# Altium schematic sheet Isolators.SchDoc
size 297 x 209 mm; SheetNumber: 17; SheetTotal: 29
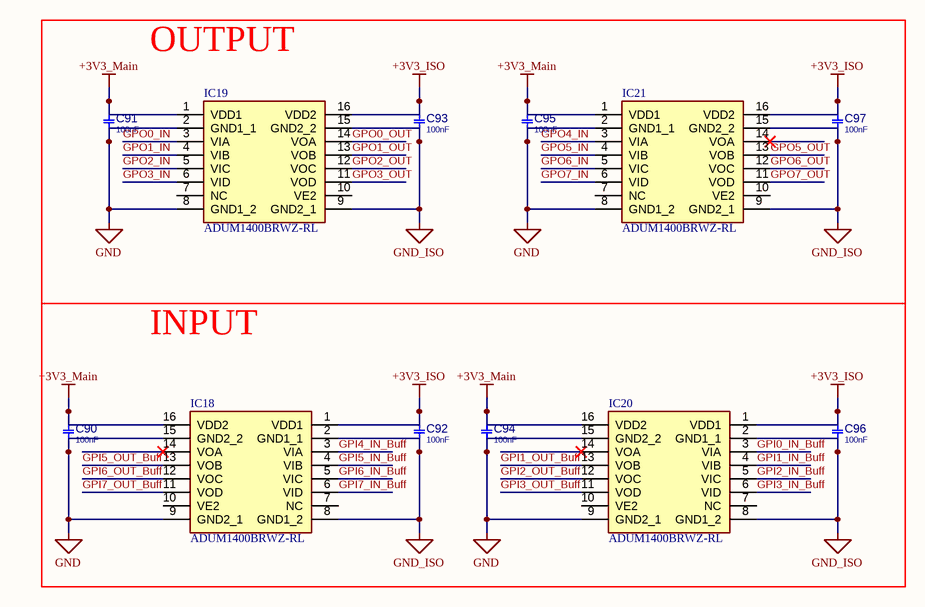
[diagram p0: Isolators.SchDoc]

## Parts
C90  100nF  [C0603]
C91  100nF  [C0603]
C92  100nF  [C0603]
C93  100nF  [C0603]
C94  100nF  [C0603]
C95  100nF  [C0603]
C96  100nF  [C0603]
C97  100nF  [C0603]
IC18  ADUM1400BRWZ-RL  [SOIC127P1032X265-16N]
IC19  ADUM1400BRWZ-RL  [SOIC127P1032X265-16N]
IC20  ADUM1400BRWZ-RL  [SOIC127P1032X265-16N]
IC21  ADUM1400BRWZ-RL  [SOIC127P1032X265-16N]

## Blocks framed on the sheet
OUTPUT: C91 C93 C95 C97 IC19 IC21

## Nets
+3V3_ISO: C92.1 C93.1 C96.1 C97.1 IC18.1(VDD1) IC19.16(VDD2) IC20.1(VDD1) IC21.16(VDD2)
+3V3_Main: C90.1 C91.1 C94.1 C95.1 IC18.16(VDD2) IC19.1(VDD1) IC20.16(VDD2) IC21.1(VDD1)
GND: C90.2 C91.2 C94.2 C95.2 IC18.9(GND2_1) IC18.15(GND2_2) IC19.2(GND1_1) IC19.8(GND1_2) IC20.9(GND2_1) IC20.15(GND2_2) IC21.2(GND1_1) IC21.8(GND1_2)
GND_ISO: C92.2 C93.2 C96.2 C97.2 IC18.2(GND1_1) IC18.8(GND1_2) IC19.9(GND2_1) IC19.15(GND2_2) IC20.2(GND1_1) IC20.8(GND1_2) IC21.9(GND2_1) IC21.15(GND2_2)
GPI0_IN_Buff: IC20.3(VIA)
GPI1_IN_Buff: IC20.4(VIB)
GPI1_OUT_Buff: IC20.13(VOB)
GPI2_IN_Buff: IC20.5(VIC)
GPI2_OUT_Buff: IC20.12(VOC)
GPI3_IN_Buff: IC20.6(VID)
GPI3_OUT_Buff: IC20.11(VOD)
GPI4_IN_Buff: IC18.3(VIA)
GPI5_IN_Buff: IC18.4(VIB)
GPI5_OUT_Buff: IC18.13(VOB)
GPI6_IN_Buff: IC18.5(VIC)
GPI6_OUT_Buff: IC18.12(VOC)
GPI7_IN_Buff: IC18.6(VID)
GPI7_OUT_Buff: IC18.11(VOD)
GPO0_IN: IC19.3(VIA)
GPO0_OUT: IC19.14(VOA)
GPO1_IN: IC19.4(VIB)
GPO1_OUT: IC19.13(VOB)
GPO2_IN: IC19.5(VIC)
GPO2_OUT: IC19.12(VOC)
GPO3_IN: IC19.6(VID)
GPO3_OUT: IC19.11(VOD)
GPO4_IN: IC21.3(VIA)
GPO5_IN: IC21.4(VIB)
GPO5_OUT: IC21.13(VOB)
GPO6_IN: IC21.5(VIC)
GPO6_OUT: IC21.12(VOC)
GPO7_IN: IC21.6(VID)
GPO7_OUT: IC21.11(VOD)

Not connected (* = marked no-connect by the designer): IC18 7(NC) 10(VE2) 14(VOA)*; IC19 7(NC) 10(VE2); IC20 7(NC) 10(VE2) 14(VOA)*; IC21 7(NC) 10(VE2) 14(VOA)*

## Notes on the sheet
- INPUT
- Drawn
- Name
- Date
- Drawing Title
- Checked
- Drawing No.
- Approved
- Size
- A4
- Ver.
- Rev.
- Sheet
- Of

## Library data of the parts
C90-C97 = CAP_SMD_MLCC_2.2u50V_0603: CAP, MLCC; MANF_P#: C1005X7R1H104K050BB; MANF: TDK; PARAM: X7R, 10%; DIST#: MOUSER; PARAM2: 50V; ASSEMBLY: ASSEMBLY; PRICE: 1000= 27$; DESC: CAP, MLCC; VALUE: 100nF
IC18-IC21 = ADUM1400BRWZ-RL: Integrated Circuit; Manufacturer_Name: Analog Devices; Datasheet Link: https://www.analog.com/ADUM1400/datasheet; Height: 2.65mm; Manufacturer_Part_Number: ADUM1400BRWZ-RL; Mouser Part Number: 584-ADUM1400BRWZ-R; Mouser Price/Stock: https://www.mouser.co.uk/ProductDetail/Analog-Devices/ADUM1400BRWZ-RL?qs=WIvQP4zGanh%2FP3K3z%252BgM%252Bw%3D%3D; Arrow Part Number: ADUM1400BRWZ-RL; Arrow Price/Stock: https://www.arrow.com/en/products/adum1400brwz-rl/analog-devices?region=nac